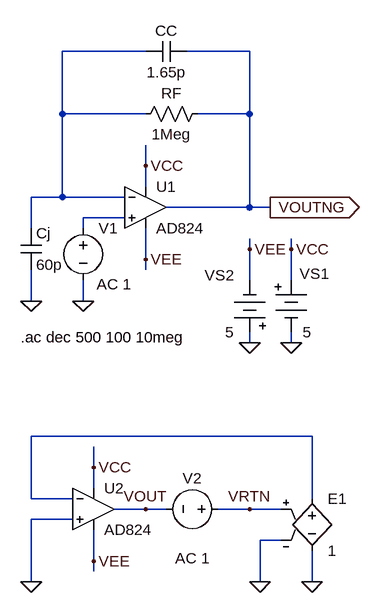
[diagram p0: schematic fig-03-03-13.asc]
fig-03-03-13.asc, the LTspice schematic file:
Version 4
SHEET 1 1004 868
WIRE 208 -64 80 -64
WIRE 368 -64 272 -64
WIRE 80 32 80 -64
WIRE 208 32 80 32
WIRE 368 32 368 -64
WIRE 368 32 288 32
WIRE 208 112 208 80
WIRE 208 144 208 112
WIRE 80 160 80 32
WIRE 80 160 32 160
WIRE 176 160 80 160
WIRE 368 176 368 32
WIRE 368 176 240 176
WIRE 400 176 368 176
WIRE 176 192 112 192
WIRE 32 208 32 160
WIRE 112 208 112 192
WIRE 368 240 368 224
WIRE 432 240 432 224
WIRE 208 256 208 208
WIRE 208 272 208 256
WIRE 368 288 368 240
WIRE 432 288 432 240
WIRE 32 320 32 272
WIRE 112 320 112 288
WIRE 368 384 368 368
WIRE 432 384 432 368
WIRE 464 528 32 528
WIRE 128 576 128 544
WIRE 128 608 128 576
WIRE 32 624 32 528
WIRE 96 624 32 624
WIRE 464 624 464 528
WIRE 208 640 160 640
WIRE 240 640 208 640
WIRE 368 640 320 640
WIRE 416 640 368 640
WIRE 96 656 32 656
WIRE 416 688 384 688
WIRE 128 720 128 672
WIRE 128 736 128 720
WIRE 32 752 32 656
WIRE 384 752 384 688
WIRE 464 752 464 704
FLAG 112 320 0
FLAG 400 176 VOUTNG
IOPIN 400 176 Out
FLAG 368 384 0
FLAG 432 384 0
FLAG 368 240 VEE
FLAG 432 240 VCC
FLAG 208 112 VCC
FLAG 208 256 VEE
FLAG 32 320 0
FLAG 32 752 0
FLAG 128 576 VCC
FLAG 128 720 VEE
FLAG 384 752 0
FLAG 464 752 0
FLAG 208 640 VOUT
FLAG 368 640 VRTN
SYMBOL res 304 16 R90
WINDOW 0 0 56 VBottom 2
WINDOW 3 32 56 VTop 2
SYMATTR InstName RF
SYMATTR Value 1Meg
SYMBOL Misc\\battery 432 272 R0
WINDOW 0 13 6 Left 2
WINDOW 3 18 96 Left 2
WINDOW 123 0 0 Left 0
WINDOW 39 0 0 Left 0
SYMATTR InstName VS1
SYMATTR Value 5
SYMBOL Misc\\battery 368 384 R180
WINDOW 0 24 104 Left 2
WINDOW 3 24 16 Left 2
WINDOW 123 0 0 Left 0
WINDOW 39 0 0 Left 0
SYMATTR InstName VS2
SYMATTR Value 5
SYMBOL Opamps\\AD824 208 112 R0
SYMATTR InstName U1
SYMBOL cap 16 208 R0
SYMATTR InstName Cj
SYMATTR Value 60p
SYMBOL cap 272 -80 R90
WINDOW 0 0 32 VBottom 2
WINDOW 3 32 32 VTop 2
SYMATTR InstName CC
SYMATTR Value 1.65p
SYMBOL voltage 112 192 R0
WINDOW 123 21 102 Left 2
WINDOW 39 0 0 Left 0
SYMATTR Value2 AC 1
SYMATTR InstName V1
SYMATTR Value ""
SYMBOL Opamps\\AD824 128 576 R0
SYMATTR InstName U2
SYMBOL e 464 608 R0
SYMATTR InstName E1
SYMATTR Value 1
SYMBOL voltage 336 640 R90
WINDOW 0 -32 56 VBottom 2
WINDOW 3 32 56 VTop 2
WINDOW 123 60 56 VTop 2
WINDOW 39 0 0 Left 0
SYMATTR InstName V2
SYMATTR Value ""
SYMATTR Value2 AC 1
TEXT 16 376 Left 2 !.ac dec 500 100 10meg

The netlist it stands for:
* fig-03-03-13.asc
RF VOUTNG N001 1Meg
VS1 VCC 0 5
VS2 0 VEE 5
XU1 N002 N001 VCC VEE VOUTNG AD824  ; pins In+ In- V+ V- OUT
Cj N001 0 60p
CC VOUTNG N001 1.65p
V1 N002 0 AC 1
XU2 0 N003 VCC VEE VOUT AD824  ; pins In+ In- V+ V- OUT
E1 N003 0 VRTN 0 1
V2 VRTN VOUT AC 1
.ac dec 500 100 10meg
.backanno
.end